# EAGLE design LEDRing (EAGLE 8.0.0)
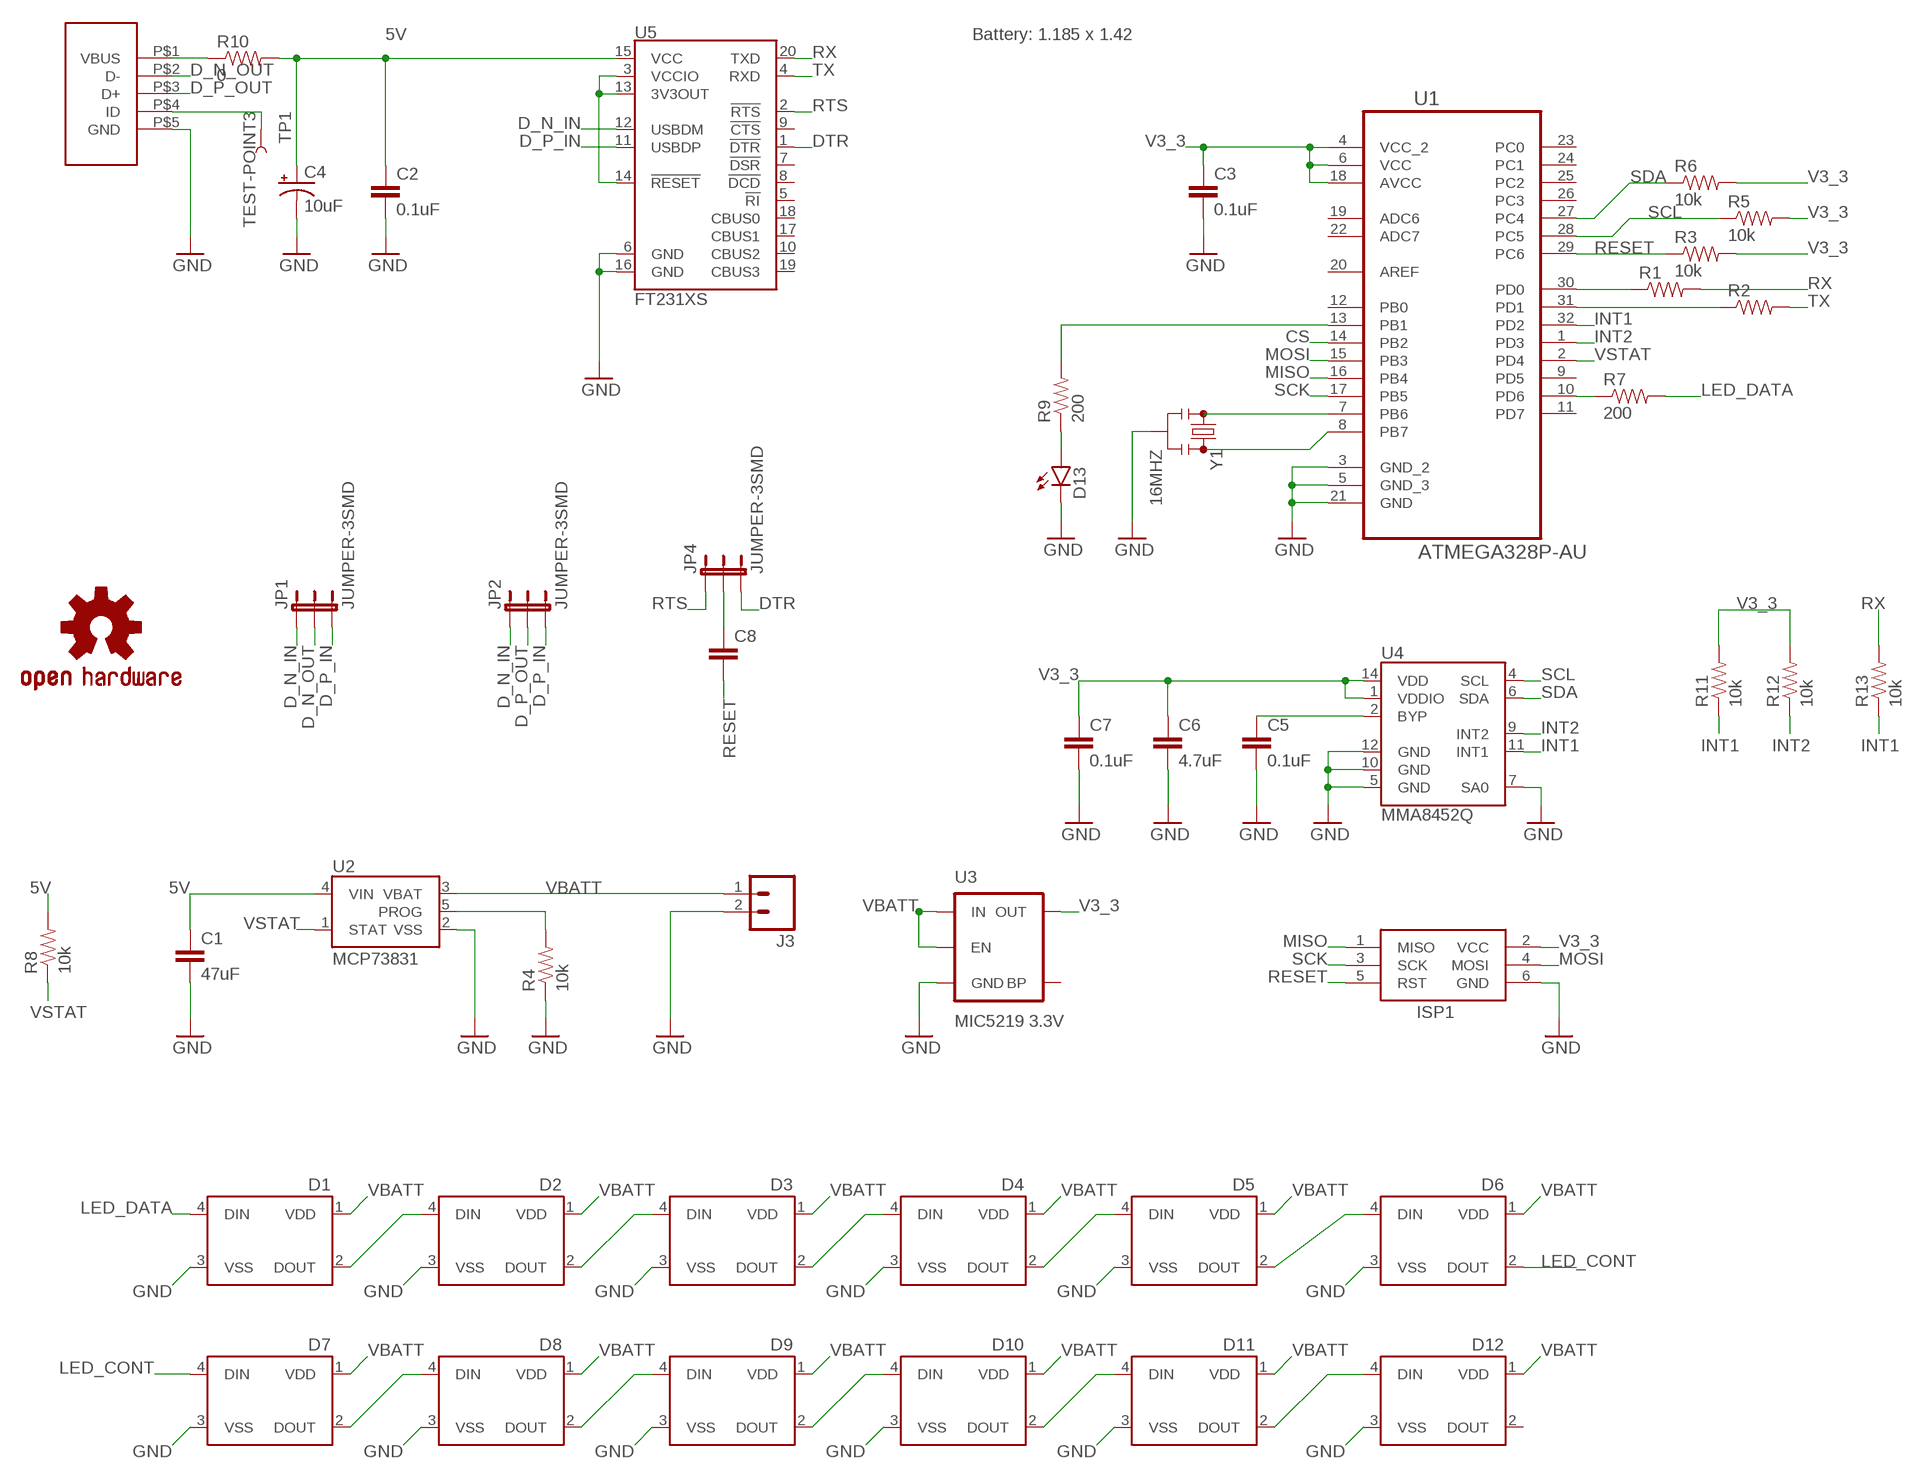
[diagram p0: schematic, sheet 1, part 1 of 2]
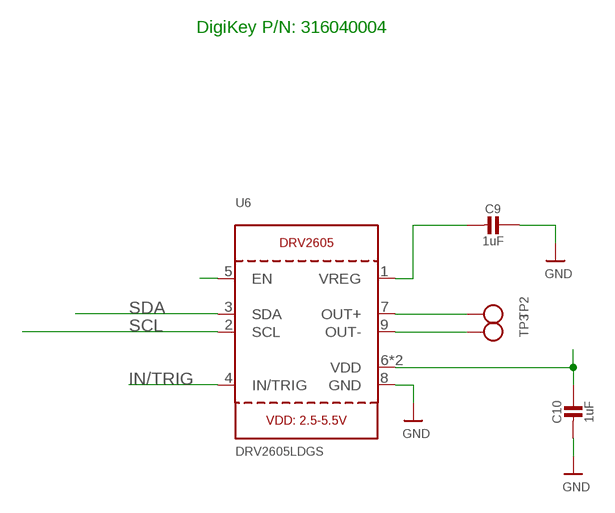
[diagram p1: schematic, sheet 1, part 2 of 2]

## Parts
C1  47uF  CAP0603-CAP  [0603-CAP]
C2  0.1uF  CAP0603-CAP  [0603-CAP]
C3  0.1uF  CAP0603-CAP  [0603-CAP]
C4  10uF  10UF-6.3V-20%(0603)(TANT)"  [0603-POL]
C5  0.1uF  CAP0603-CAP  [0603-CAP]
C6  4.7uF  CAP0603-CAP  [0603-CAP]
C7  0.1uF  CAP0603-CAP  [0603-CAP]
C8  CAP0603-CAP  [0603-CAP]
C9  1uF  CAP_CERAMIC0805-NOOUTLINE  [0805-NO]
C10  1uF  CAP_CERAMIC0805-NOOUTLINE  [0805-NO]
D1  WS2812B  [WS2812B]
D2  WS2812B  [WS2812B]
D3  WS2812B  [WS2812B]
D4  WS2812B  [WS2812B]
D5  WS2812B  [WS2812B]
D6  WS2812B  [WS2812B]
D7  WS2812B  [WS2812B]
D8  WS2812B  [WS2812B]
D9  WS2812B  [WS2812B]
D10  WS2812B  [WS2812B]
D11  WS2812B  [WS2812B]
D12  WS2812B  [WS2812B]
D13  LED0603  [LED-0603]
ISP1  AVRISP-BOX  [AVRISP-BOX]
J3  M02PTH  [1X02]
JP1  JUMPER-3SMD  [SJ_3]
JP2  JUMPER-3SMD  [SJ_3]
JP4  JUMPER-3SMD  [SJ_3]
LOGO1  OSHW-LOGOMINI  [OSHW-LOGO-MINI]
R1  RESISTOR0603-RES  [0603-RES]
R2  RESISTOR0603-RES  [0603-RES]
R3  10k  RESISTOR0603-RES  [0603-RES]
R4  10k  RESISTOR0603-RES  [0603-RES]
R5  10k  RESISTOR0603-RES  [0603-RES]
R6  10k  RESISTOR0603-RES  [0603-RES]
R7  200  RESISTOR0603-RES  [0603-RES]
R8  10k  RESISTOR0603-RES  [0603-RES]
R9  200  RESISTOR0603-RES  [0603-RES]
R10  0  RESISTOR0603-RES  [0603-RES]
R11  10k  RESISTOR0603-RES  [0603-RES]
R12  10k  RESISTOR0603-RES  [0603-RES]
R13  10k  RESISTOR0603-RES  [0603-RES]
TP1  TEST-POINT3  [PAD.03X.03]
TP2  TESTPOINTPAD2MM  [TESTPOINT_PAD_2MM]
TP3  TESTPOINTPAD2MM  [TESTPOINT_PAD_2MM]
U1  ATMEGA328P-AU  [QFP80P900X900X120-32N]
U2  MCP73831  [SOT23-5]
U3  MIC5219 3.3V  V_REG_MIC52193.3V  [SOT23-5]
U4  MMA8452Q  [QFN-16_0.5MM]
U5  FT231XS  [SSOP20_L]
U6  DRV2605LDGS  DRV2605_SOP  [PSOP10]
U$1  TE_USB_A121025CT  [TE_USB_A121025CT]
Y1  16MHZ  RESONATOR16MHZ  [RESONATOR-SMD]

## Nets
5V: C1.1 C2.1 C4.A(+) R8.2 R10.2 U2.4(VIN) U5.15(VCC)
CS: U1.14(PB2)
D_N_IN: JP1.1 JP2.1 U5.12(USBDM)
D_N_OUT: JP1.2 U$1.P$2(D-)
D_P_IN: JP1.3 JP2.3 U5.11(USBDP)
D_P_OUT: JP2.2 U$1.P$3(D+)
DTR: JP4.3 U5.1(!DTR)
GND: C1.2 C2.2 C3.2 C4.K(-) C5.2 C6.2 C7.2 C9.1 C10.2 D1.3(VSS) D2.3(VSS) D3.3(VSS) D4.3(VSS) D5.3(VSS) D6.3(VSS) D7.3(VSS) D8.3(VSS) D9.3(VSS) D10.3(VSS) D11.3(VSS) D12.3(VSS) D13.C ISP1.6(GND) J3.2 R4.1 U1.3(GND_2) U1.5(GND_3) U1.21(GND) U2.2(VSS) U3.2(GND) U4.5(GND) U4.7(SA0) U4.10(GND) U4.12(GND) U5.6(GND) U5.16(GND) U6.8(GND) U$1.P$5(GND) Y1.2
IN/TRIG: U6.4(IN/TRIG)
INT1: R11.1 R13.1 U1.32(PD2) U4.11(INT1)
INT2: R12.1 U1.1(PD3) U4.9(INT2)
LED_CONT: D6.2(DOUT) D7.4(DIN)
LED_DATA: D1.4(DIN) R7.2
MISO: ISP1.1(MISO) U1.16(PB4)
MOSI: ISP1.4(MOSI) U1.15(PB3)
N$1: R1.1 U1.30(PD0)
N$2: R2.1 U1.31(PD1)
N$3: C5.1 U4.2(BYP)
N$4: R10.1 U$1.P$1(VBUS)
N$5: U5.3(VCCIO) U5.13(3V3OUT) U5.14(!RESET)
N$7: U1.8(PB7) Y1.3
N$8: U1.7(PB6) Y1.1
N$9: R4.2 U2.5(PROG)
N$10: R7.1 U1.10(PD6)
N$15: D1.2(DOUT) D2.4(DIN)
N$16: D2.2(DOUT) D3.4(DIN)
N$17: D3.2(DOUT) D4.4(DIN)
N$18: D4.2(DOUT) D5.4(DIN)
N$19: D5.2(DOUT) D6.4(DIN)
N$20: D7.2(DOUT) D8.4(DIN)
N$21: D8.2(DOUT) D9.4(DIN)
N$22: D9.2(DOUT) D10.4(DIN)
N$23: D10.2(DOUT) D11.4(DIN)
N$24: D11.2(DOUT) D12.4(DIN)
N$32: C9.2 U6.1(VREG)
N$33: R9.2 U1.13(PB1)
N$34: D13.A R9.1
N$35: TP1.P$1 U$1.P$4(ID)
N$36: C10.1 U6.6(VDD) U6.10(VDD)
N$37: U6.5(EN)
OUT+: TP2.P$1 U6.7(OUT+)
OUT-: TP3.P$1 U6.9(OUT-)
RESET: C8.2 ISP1.5(RST) R3.1 U1.29(PC6)
RTS: JP4.1 U5.2(!RTS)
RTS_OR_DTR: C8.1 JP4.2
RX: R1.2 R13.2 U5.20(TXD)
SCK: ISP1.3(SCK) U1.17(PB5)
SCL: R5.1 U1.28(PC5) U4.4(SCL) U6.2(SCL)
SDA: R6.1 U1.27(PC4) U4.6(SDA) U6.3(SDA)
TX: R2.2 U5.4(RXD)
V3_3: C3.1 C6.1 C7.1 ISP1.2(VCC) R3.2 R5.2 R6.2 R11.2 R12.2 U1.4(VCC_2) U1.6(VCC) U1.18(AVCC) U3.5(OUT) U4.1(VDDIO) U4.14(VDD)
VBATT: D1.1(VDD) D2.1(VDD) D3.1(VDD) D4.1(VDD) D5.1(VDD) D6.1(VDD) D7.1(VDD) D8.1(VDD) D9.1(VDD) D10.1(VDD) D11.1(VDD) D12.1(VDD) J3.1 U2.3(VBAT) U3.1(IN) U3.3(EN)
VSTAT: R8.1 U1.2(PD4) U2.1(STAT)
Unconnected: D12.2(DOUT) U1.9(PD5) U1.11(PD7) U1.12(PB0) U1.19(ADC6) U1.20(AREF) U1.22(ADC7) U1.23(PC0) U1.24(PC1) U1.25(PC2) U1.26(PC3) U3.4(BP) U5.5(!RI) U5.7(!DSR) U5.8(!DCD) U5.9(!CTS) U5.10(CBUS2) U5.17(CBUS1) U5.18(CBUS0) U5.19(CBUS3)

## Notes on the sheet
- Battery: 1.185 x 1.42
- DigiKey P/N: 316040004

## Library data of the parts
C1-C3 C5-C8 = SparkFun-Capacitors:CAP: Capacitor Standard 0603 ceramic capacitor, and 0.1" leaded capacitor.
C4 = SparkFun-Capacitors:10UF-6.3V-20%(0603)(TANT); PROD_ID: CAP-13210
C9 C10 = microbuilder:CAP_CERAMIC: Ceramic Capacitors For new designs, use the packages preceded by an '_' character since they are more reliable: The following footprints should be used on most boards: _0402 - Standard footprint for regular board layouts _0603 - Standard footprint for regular board layouts _0805 - Standard footprint for regular board layouts _1206 - Standard footprint for regular board layouts For extremely tight-pitch boards where space is at a premium, the following 'micro-pitch' footprints can be used (smaller pads, no silkscreen outline, etc.): _0402MP - Micro-pitch footprint for very dense/compact boards _0603MP - Micro-pitch footprint for very dense/compact boards _0805MP - Micro-pitch footprint for very dense/compact boards _1206MP - Micro-pitch footprint for very dense/compact boards
D1-D12 = SparkFun-LED:WS2812B: WS2812B - Intelligent control LED integrated light source Technical Specifications: Power Supply Voltage (VDD): 3.5 to 5.3 V Input Voltage (VI): -0.5 to VDD+0.5 V Operating Junction Temperature (Topt): -25°C to +80°C Storage Temperature Range (Tstg): -55°C to +150°C; PROD_ID: DIO-12503
D13 = SparkFun-LED:LED: LEDs Standard schematic elements and footprints for 5mm, 3mm, 1206, and 0603 sized LEDs. 5mm - Spark Fun Electronics SKU : COM-00529 (and others)
ISP1 = adafruit:AVRISP: AVR ISP HEADER Standard 6 pin header for AVR programming
J3 = SparkFun-Connectors:M02: Standard 2-pin 0.1" header. Use with - straight break away headers ( PRT-00116) - right angle break away headers (PRT-00553) - swiss pins (PRT-00743) - machine pins (PRT-00117) - female headers (PRT-00115) Molex polarized connector foot print use with: PRT-08233 with associated crimp pins and housings. 2.54_SCREWTERM for use with PRT-10571. 3.5mm Screw Terminal footprints for PRT-08084 5mm Screw Terminal footprints for use with PRT-08432
JP1 JP2 JP4 = SparkFun-Retired:JUMPER-3
LOGO1 = SparkFun-Aesthetics:OSHW-LOGO: Open Source Hardware Logo This logo indicates the piece of hardware it is found on incorporates a OSHW license and/or adheres to the definition of open source hardware found here: http://freedomdefined.org/OSHW
R1-R13 = SparkFun-Passives:RESISTOR: Resistor Basic schematic elements and footprints for 0603, 1206, and PTH resistors.
TP1 = SparkFun-Passives:TEST-POINT: Bare copper test points for troubleshooting or ICT
TP2 TP3 = microbuilder:TESTPOINT: Test Point Various test points for characterisation and PCB testing TESTPOINT_SMT - Compact Surface Mount Test Point [Digikey: 5016KTR-ND]
U1 = Atmel_By_element14_Batch_1-00:ATMEGA328P-AU: 8-bit Microcontroller with In-System Programmable Flash; MPN: ATMEGA328P-AU; OC_FARNELL: 1715486; OC_NEWARK: 14R4631; PACKAGE: TQFP-32; SUPPLIER: Atmel
U2 = SparkFun-PowerIC:MCP73831: Miniature single cell, fully integrated Li-Ion, Li-polymer charge management controller http://ww1.microchip.com/downloads/en/DeviceDoc/20001984g.pdf IC-09995; PROD_ID: IC-09995
U3 = SparkFun-PowerIC:V_REG_MIC5219: V_REG MIC5219 Standard 3.3V and 5V 500mA LDO voltage regulator in SOT-23 layout. Micrel part MIC5219. BP (by-pass) pin is used to lower output noise with 470pF cap, may be left open.; PROD_ID: VREG-09872
U4 = SparkFun-Sensors:MMA8452Q: MMA8452Q 3-Axis, 12/8-bit Digital Accelerometer Supply Voltage: 1.6-3.6V Range: +/- 2g, 4g, 8g Interface: I2C, 12-bit and 8-bit ODR: 1.56 Hz - 800 Hz Package: QFN-16 http://cache.freescale.com/files/sensors/doc/data_sheet/MMA8452Q.pdf; PROD_ID: IC-10769
U5 = SparkFun-DigitalIC:FT231X: FTDI FT231X Full Speed USB to Full-handshake UART This USB2.0 Full Speed IC offers a compact bridge to full handshake UART interfaces. The device is a UART, capable of operating up to 3MBaud, with low power consumption (8mA). The FT231X includes the complete FT-X series feature set and enables USB to be added into a system design quickly and easily over a UART interface.; PROD_ID: IC-11524
U6 = microbuilder:DRV2605: DRV2605 - Haptic Driver for ERM/LRA Motors
U$1 = LEDRingLib:TE_USB_A121025CT: TE USB Micro USB IP68 Digikey <http://www.digikey.com/en/ptm/t/te-connectivity/te-connectivity-amp/ip68-micro-usb?pn_sku=A121025CT-ND&part_id=5215144&video_source=Part_Detail>
Y1 = SparkFun-FreqCtrl:RESONATOR: Resonator Small SMD resonator. Used, eg, on the Arduino Pro/ Pro Mini boards. 8MHz- XTAL-08895 16MHz- XTAL-08900; PROD_ID: XTAL-08900

## Board
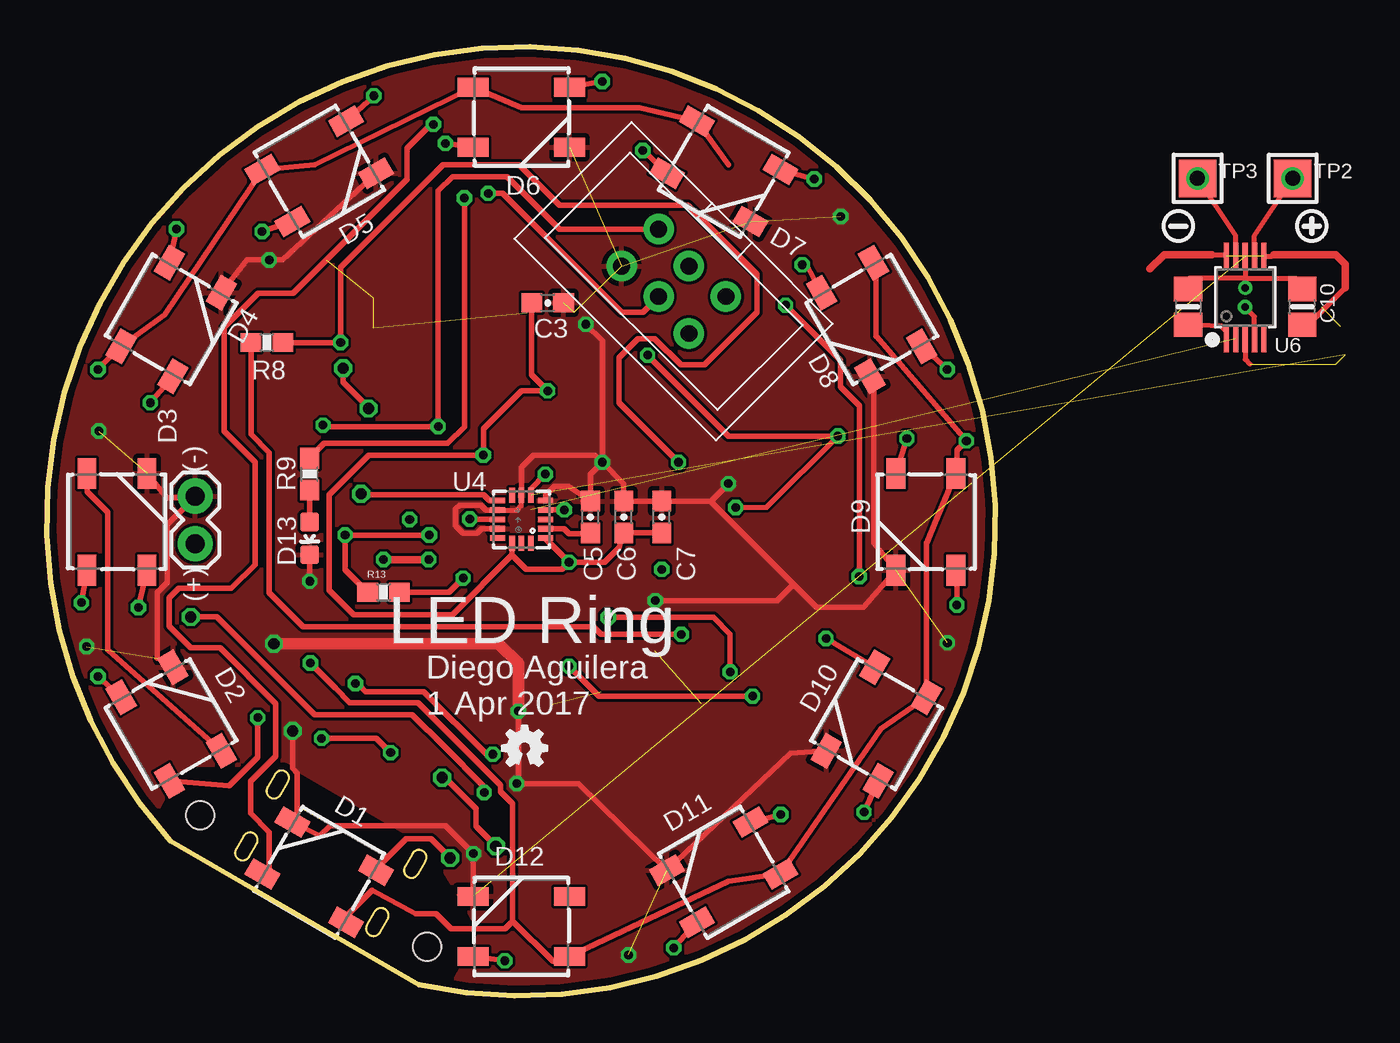
[diagram p2: board, top side]
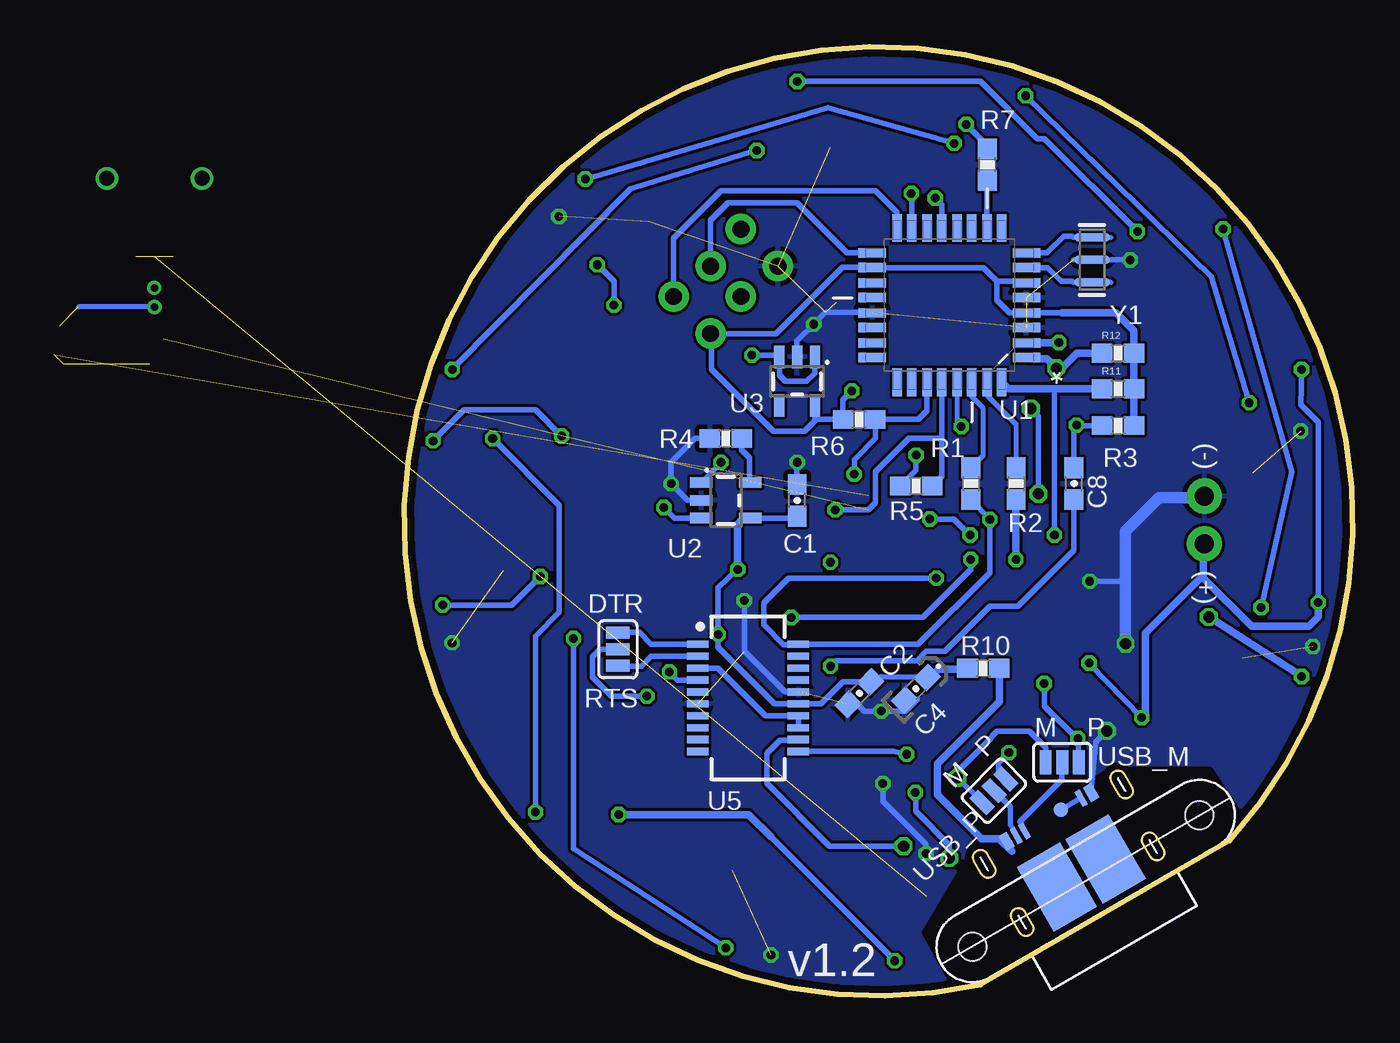
[diagram p3: board, bottom side, seen from below]

Size 50.62 x 50.64 mm. Coordinates in mm from the lower left corner, seen from the top.
Outline: 6.57,8.29 19.87,0.59 arc325 6.57,8.29
Copper layers (1*16): Top 0.0356mm / dielectric 1.5011mm / Bottom 0.0356mm
Design rules "oshpark-2layer": minimum track width 6mil, minimum drill 13mil, track to track 6mil, track to pad 6mil, pad to pad 6mil, via to via 6mil, smd to smd 6mil, copper to edge 15mil, drill to drill 6mil, minimum pad ring 7mil, minimum via ring 7mil, stop-mask expansion 2.5mil, vias tented up to drill 0mil, thermal gap 10mil

### Footprints (pad centres in the part's own frame; a part is rotated, then mirrored left to right if it is on the bottom)
0603-CAP = smd 1.1 x 1: 1 -0.85,0; 2 0.85,0
0603-POL = smd 1.1 x 1: A 0.85,0; K -0.85,0
0805-NO = smd 1.3 x 1.5: 1 -0.95,0; 2 0.95,0
WS2812B = smd 1.651 x 1: 1 -2.577,1.6; 2 -2.577,-1.6; 3 2.577,-1.6; 4 2.577,1.6
LED-0603 = smd 1 x 1: A 0,-0.877; C 0,0.877
AVRISP-BOX = drill 0.9 pad 1.626: 1 -1.397,2.54; 2 1.397,2.54; 3 -1.143,0; 4 1.143,0; 5 -1.397,-2.54; 6 1.397,-2.54
1X02 = drill 1.016 pad 1.88: 1 0,0; 2 2.54,0
SJ_3 = smd 0.635 x 1.27: 1 -0.889,0; 2 0,0; 3 0.889,0
0603-RES = smd 1.1 x 1: 1 -0.85,0; 2 0.85,0
PAD.03X.03 = smd 0.762 x 0.762: P$1 0,0
TESTPOINT_PAD_2MM = smd 2 x 2: P$1 0,0
QFP80P900X900X120-32N = smd 1.473 x 0.508: 1 -4.115,2.794; 2 -4.115,2.007; 3 -4.115,1.194; 4 -4.115,0.406; 5 -4.115,-0.406; 6 -4.115,-1.194; 7 -4.115,-2.007; 8 -4.115,-2.794; 17 4.115,-2.794; 18 4.115,-2.007; 19 4.115,-1.194; 20 4.115,-0.406; 21 4.115,0.406; 22 4.115,1.194; 23 4.115,2.007; 24 4.115,2.794 | smd 0.508 x 1.473: 9 -2.794,-4.115; 10 -2.007,-4.115; 11 -1.194,-4.115; 12 -0.406,-4.115; 13 0.406,-4.115; 14 1.194,-4.115; 15 2.007,-4.115; 16 2.794,-4.115; 25 2.794,4.115; 26 2.007,4.115; 27 1.194,4.115; 28 0.406,4.115; 29 -0.406,4.115; 30 -1.194,4.115; 31 -2.007,4.115; 32 -2.794,4.115
SOT23-5 = smd 0.55 x 1.2: 1 -0.95,-1.3; 2 0,-1.3; 3 0.95,-1.3; 4 0.95,1.3; 5 -0.95,1.3
QFN-16_0.5MM = smd 0.8 x 0.3: 1 -1.275,1; 2 -1.275,0.5; 3 -1.275,0; 4 -1.275,-0.5; 5 -1.275,-1; 9 1.275,-1; 10 1.275,-0.5; 11 1.275,0; 12 1.275,0.5; 13 1.275,1 | smd 0.3 x 0.8: 6 -0.5,-1.275; 7 0,-1.275; 8 0.5,-1.275; 14 0.5,1.275; 15 0,1.275; 16 -0.5,1.275
SSOP20_L = smd 0.381 x 1.143: 1 -2.857,-2.68; 2 -2.223,-2.68; 3 -1.587,-2.68; 4 -0.953,-2.68; 5 -0.318,-2.68; 6 0.318,-2.68; 7 0.953,-2.68; 8 1.587,-2.68; 9 2.223,-2.68; 10 2.857,-2.68; 11 2.857,2.68; 12 2.223,2.68; 13 1.587,2.68; 14 0.953,2.68; 15 0.318,2.68; 16 -0.318,2.68; 17 -0.953,2.68; 18 -1.587,2.68; 19 -2.223,2.68; 20 -2.857,2.68
PSOP10 = smd 0.28 x 1.45: 1 -1,-2.2; 2 -0.5,-2.2; 3 0,-2.2; 4 0.5,-2.2; 5 1,-2.2; 6 1,2.2; 7 0.5,2.2; 8 0,2.2; 9 -0.5,2.2; 10 -1,2.2
TE_USB_A121025CT = smd 0.5 x 0.9: P$1 2.6,-5.75; P$5 -2.6,-5.75 | smd 0.3 x 0.9: P$2 2,-5.75; P$3 1.5,-5.75; P$4 -2,-5.75 | smd 2.65 x 3.98: P$6 -1.5,-2.29; P$7 1.5,-2.29 | hole 1.5: -7,-1.8; 7,-1.8
RESONATOR-SMD = smd 0.45 x 1.905: 1 -1.2,0; 2 0,0; 3 1.2,0

### Placement (x,y rotation side)
C1  29.65,26.44 90 bottom
C2  26.33,16.15 225 bottom
C3  26.73,36.98 0 top
C4  23.32,16.39 45 bottom
C5  29.02,25.55 90 top
C6  30.8,25.55 90 top
C7  32.83,25.55 90 top
C8  14.88,27.33 90 bottom
C9  60.91,36.76 270 top  (outside the outline)
C10  67.01,36.76 90 top  (outside the outline)
D1  14.54,6.6 150 top
D2  6.64,14.5 120 top
D3  3.74,25.3 90 top
D4  6.64,36.09 60 top
D5  14.54,43.99 30 top
D6  25.33,46.89 0 top
D7  36.13,43.99 330 top
D8  44.03,36.09 300 top
D9  46.92,25.3 270 top
D10  44.28,14.5 240 top
D11  36.13,6.6 210 top
D12  25.33,3.71 180 top
D13  14.03,24.41 180 top
ISP1  33.46,38.12 225 top
J3  7.92,24.13 90 top
JP1  19.14,10.95 45 bottom
JP2  15.5,12.47 0 bottom
JP4  39.22,18.49 90 bottom
LOGO1  25.5,13.23 0 top
R1  20.38,27.33 270 bottom
R2  17.97,27.33 270 bottom
R3  12.52,30.43 0 bottom
R4  33.46,29.74 0 bottom
R5  23.3,27.2 180 bottom
R6  26.35,30.76 180 bottom
R7  19.49,44.35 90 bottom
R8  11.75,34.86 180 top
R9  14.03,27.84 90 top
R10  19.72,17.47 180 bottom
R11  12.52,32.39 0 bottom
R12  12.52,34.29 0 bottom
R13  17.97,21.54 0 top
TP1  15.57,9.94 0 bottom
TP2  66.5,43.62 0 top  (outside the outline)
TP3  61.42,43.62 0 top  (outside the outline)
U1  21.52,36.85 180 bottom
U2  33.46,26.44 270 bottom
U3  29.65,32.79 180 bottom
U4  25.33,25.42 180 top
U5  32.27,15.9 270 bottom
U6  63.96,37.27 0 top  (outside the outline)
U$1  13.35,4.57 210 bottom
U$5  [SYMBOL_PLUS]  67.52,41.08 90 top  (outside the outline)
U$13  [SYMBOL_MINUS]  60.41,41.08 0 top  (outside the outline)
Y1  13.9,39.27 90 bottom

### Tracks (layer width: path | path; a pad name or v marks a point on that pad's centre or on a via)
5V  (via drill 0.46, 0.46 pad 0.25)
  Top 0.305: R8.2 10.9,29.96 11.87,28.98 11.87,22.63 11.87,21.5 13.14,20.23 13.67,19.7 13.67,19.69 29.17,19.69 29.57,19.29 v33.87,19.29
  Bottom 0.305: U2.4 29.75,25.49 C1.1 | C4.A 25.19,17.04 C2.1 27.21,16.75 28.37,15.59 U5.15 30.27,15.58 30.27,15.59 30.87,15.59 33.87,18.59 v33.87,19.29 33.87,21.79 v32.83,22.76
  Bottom 0.406: U2.4 32.51,25.49 32.83,25.17 v32.83,22.76 | R10.2 20.6,17.44 22.12,17.44 22.57,16.99 C4.A
D_N_IN  (via drill 0.6 pad 0.25)
  Top 0.305: v21.1,11.65 21.26,11.65 22.92,9.99 22.92,9.04 v23.97,7.99
  Bottom 0.305: JP1.1 v21.1,11.65 21.1,11.96 19.32,13.74 19.24,13.87 18.98,14.12 17.25,14.12 16.37,13.24 16.37,12.49 JP2.1 | v23.97,7.99 27.92,7.99 31.27,11.34 31.27,12.94 30.57,13.64 29.63,13.64 U5.12
D_N_OUT
  Bottom 0.305: JP1.2 18.27,10.09 18.27,9.14 U$1.P$2
D_P_IN  (via drill 0.46)
  Top 0.305: v18.35,12.98 17.59,13.74 v14.67,13.74 | v23.81,12.89 23.81,12.85 23.77,12.89 23.47,12.89 20.12,16.24 17.02,16.24 16.59,16.67 v16.47,16.67
  Bottom 0.305: 18.37,12.95 v18.35,12.98 18.38,12.98 18.92,12.44 18.92,11.99 JP1.3 | 14.6,13.68 v14.67,13.74 | U5.11 24.51,13.04 v23.81,12.89 | v14.67,13.74 14.73,13.74 16.42,15.44 16.47,15.48 v16.47,16.67 | JP2.3 v14.67,13.74
D_P_OUT
  Bottom 0.305: JP2.2 15.52,12.45 15.52,11.54 17.77,9.29 U$1.P$3
DTR
  Bottom 0.305: U5.1 37.44,18.76 38.07,19.39 JP4.3
GND  (via drill 0.39, 0.46, 0.46 pad 0.25, 0.6, 0.6 pad 0.25)  (15 unrouted)
  Top 0.254: U4.7 25.32,26.69 25.32,26.14 25.11,25.92 U4.10 | U6.8 v63.96,37.77 63.96,38.28 | 63.96,38.28 60.98,38.28 C9.1 | 63.96,38.28 66.69,38.28 C10.2
  Top 0.305: 28.61,26.42 C5.2 | U4.5 26.61,26.7 27.11,27.2 27.84,27.2 C5.2 | C5.2 29.02,27.84 v29.65,28.47 | v29.65,28.47 30.8,27.33 C6.2 C7.2 35.46,26.4 35.49,26.44 | v29.65,28.47 29.65,34.95 v28.76,35.84 | U4.7 25.33,28.22 25.97,28.85 29.27,28.85 v29.65,28.47 | D2.3 5.9,18.01 5.9,21.52 6.42,22.04 6.42,25.14 7.92,26.64 J3.2 7.81,26.57 6.4,26.57 D3.3 | D10.3 39.7,12.94 D11.3 28.37,11.33 v25.08,11.33 25.17,11.42 v25.17,15.19 | D8.3 43.92,33.09 44.16,32.85 44.16,24.14 D9.3 43.58,20.72 41.08,20.72 39.85,21.96 | v36.38,27.33 35.49,26.44 | 35.49,26.44 35.49,26.31 39.85,21.96 | D4.3 10.7,39.27 v11.87,39.27 12.59,39.27 D5.3 | D13.C v14.03,22.12 | D12.3 22.76,7.57 v22.77,7.59 21.27,9.09 15.12,9.09 14.57,8.54 D1.3 13.37,9.54 13.37,11.89 13.12,12.14 v13.12,14.14 | v32.47,21.09 38.97,21.09 39.85,21.96 | U4.10 23.44,25.92 23.17,26.19 22.02,26.19 21.82,25.99 21.82,25.09 22.22,24.69 22.97,24.69 23.21,24.92 U4.12
  Top 0.61: v12.12,18.79 24.12,18.79 25.17,17.74 v25.17,15.19
  Bottom 0.305: R4.1 35.11,29.74 36.38,28.47 v36.38,27.33 35.49,26.44 U2.2 | U3.2 29.65,34.95 v28.76,35.84 28.13,36.47 25.66,36.47 U1.21 | C1.2 v29.65,28.47 | v11.87,39.27 12.89,39.27 | v14.03,22.12 12.25,22.12 12.13,22.25 | C4.K 23.22,15.84 23.87,15.19 v25.17,15.19 26.07,15.19 26.44,15.55 C2.2 | v25.08,11.33 v25.07,11.32 25.07,10.39 22.77,8.09 v22.77,7.59 | U5.16 30.3,16.22 32.47,18.39 v32.47,21.09 | U$1.P$5 13.7,13.57 v13.12,14.14
  Bottom 0.61: v12.12,18.79 12.13,20.13 12.13,22.25 12.13,24.79 10.35,26.57 8.02,26.57 J3.2
  other vias: 31.05,2.18 48.07,18.84 2.77,30.14 42.37,41.59 2.12,18.64
  pour Bottom: -0.7,-0.48 52.26,-0.48 52.26,52.47 -0.7,52.47
  pour Top: -0.7,-0.48 52.89,-0.48 52.89,53.62 -0.7,53.62
IN/TRIG  (via drill 0.4)  (1 unrouted)
  Top 0.254: U6.4 64.46,36.26 v63.96,36.76
  Bottom 0.254: v63.96,36.76 68.03,36.76
INT1  (via drill 0.46 pad 0.25)
  Top 0.305: U4.11 23.09,25.42 v22.57,25.44 | v20.42,24.59 v15.92,24.59 15.92,22.74 R13.1
  Bottom 0.305: v22.57,25.44 21.27,25.44 v20.42,24.59 | v15.92,24.59 15.92,32.34 15.97,32.39
  Bottom 0.406: R11.1 15.97,32.39 18.38,32.39 U1.32
INT2  (via drill 0.6 pad 0.25)
  Top 0.305: U4.9 23.64,26.42 23.32,26.74 16.82,26.74 v16.77,26.79 | v17.17,31.34 17.17,31.39 15.82,32.74 v15.82,33.49
  Bottom 0.305: v16.77,26.79 16.77,30.94 v17.17,31.34
  Bottom 0.406: R12.1 14.72,34.29 15.52,33.49 v15.82,33.49 16.32,33.99 17.34,33.99 U1.1
LED_CONT  (via drill 0.46 pad 0.25)
  Top 0.305: D7.4 v40.96,43.58 | D6.2 v21.27,45.49
  Bottom 0.305: v40.96,43.58 28,47.39 v21.27,45.49
LED_DATA  (via drill 0.46 pad 0.25)
  Top 0.305: v20.64,46.51 20.51,46.51 19.24,45.24 19.24,43.58 13.14,37.49 11.27,37.49 9.46,35.68 9.46,30.12 11.11,28.47 11.11,23.01 9.84,21.74 7.05,21.74 6.54,21.23 6.54,19.71 7.68,18.57 9.25,18.57 12.22,15.59 12.22,12.79 10.87,11.44 10.87,9.74 11.87,8.74 11.87,6.87 D1.4
  Bottom 0.305: R7.2 19.49,45.36 v20.64,46.51
MISO
  Bottom 0.305: ISP1.1 36.25,40.42 33.72,42.95 25.46,42.95 24.32,41.81 U1.16
MOSI  (via drill 0.46 pad 0.25)
  Top 0.305: ISP1.4 31.81,36.47 30.67,36.47 24.32,42.82 v23.56,42.82
  Bottom 0.305: U1.15 23.53,42.8 v23.56,42.82
N$1
  Bottom 0.254: U1.30 20.33,31.98 19.75,31.39 19.75,28.81 R1.1
  Bottom 0.305: R1.1 20.33,28.18
N$2
  Bottom 0.254: U1.31 19.52,32.05 17.97,30.5 R2.1
N$3
  Top 0.305: U4.2 27.61,24.92 27.87,24.66 28.6,24.66 C5.1
N$4
  Bottom 0.406: U$1.P$1 18.2,7.72 18.87,8.39 19.82,8.39 22.17,10.74 22.17,12.39 18.87,15.69 R10.1
N$5
  Bottom 0.305: U5.13 U5.14 31.33,14.95 33.87,17.49 U5.3
N$7
  Bottom 0.305: U1.8 16.32,39.65 15.43,40.54 14.99,40.54 14.92,40.47
N$8
  Bottom 0.305: U1.7 16.29,38.86 15.56,38.12 14.98,38.12 14.92,38.07
N$9
  Bottom 0.305: R4.2 32.61,29.15 32.19,28.73 32.19,27.42 U2.5
N$10
  Bottom 0.305: R7.1 19.52,43.47 U1.10
N$15  (via drill 0.46 pad 0.25, 0.6)
  Top 0.305: D2.4 v2.73,17.04 | v7.68,20.22 9.08,20.22 14.29,15.01 19.49,15.01 21.19,13.31 23.32,11.19 23.32,10.87 v23.34,10.85 | D1.2 17.57,6.79 19.17,8.39 20.5,8.39 v21.53,7.36
  Bottom 0.305: v21.53,7.36 v21.52,7.37 21.52,8.04 23.32,9.84 23.32,10.83 v23.34,10.85
  Bottom 0.406: v7.68,20.22 v2.73,17.04 2.86,17.04
N$16
  Top 0.305: D2.2 3.24,18.46 3.24,25.8 2.14,26.9 D3.4
N$17  (via drill 0.46 pad 0.25)
  Top 0.305: D4.4 v6.92,40.92 | D3.2 v4.89,20.72
  Bottom 0.305: v6.92,40.92 3.24,27.96 v4.89,20.72
N$18  (via drill 0.46 pad 0.25)
  Top 0.305: D5.4 v17.46,48.03 | D4.2 v5.52,31.65
  Bottom 0.305: v17.46,48.03 7.55,38.38 v5.52,31.65
N$19  (via drill 0.46 pad 0.25)
  Top 0.305: D6.4 v29.65,48.79 | D5.2 v11.49,40.79
  Bottom 0.305: v11.49,40.79 16.44,45.74 16.83,45.74 19.87,48.79 v29.65,48.79
N$20  (via drill 0.46 pad 0.25)
  Top 0.305: D8.4 v48.07,33.42 | D7.2 v31.81,45.11
  Bottom 0.305: v48.07,33.42 38.54,43.08 v31.81,45.11
N$21  (via drill 0.46 pad 0.25)
  Top 0.305: D9.4 48.58,22.61 v48.58,20.85 | D8.2 40.55,39.01 v40.32,39.01 | v39.43,36.85 42.37,33.91 42.37,32.49 43.37,31.49 v43.37,22.38
  Bottom 0.305: v48.58,20.85 44.89,20.85 v43.37,22.38 | v39.43,36.85 39.43,38.12 v40.32,39.01
N$22  (via drill 0.46 pad 0.25)
  Top 0.305: D9.2 v45.91,29.74 | D10.4 v43.62,9.8
  Bottom 0.305: v43.62,9.8 43.62,19.2 42.35,20.47 42.35,26.19 v45.91,29.74
N$23  (via drill 0.46 pad 0.25)
  Top 0.305: D11.4 v33.46,2.56 | D10.2 v41.59,19.07
  Bottom 0.305: v33.46,2.56 41.46,7.77 41.57,7.84 41.59,7.86 v41.59,19.07
N$24  (via drill 0.46 pad 0.25)
  Top 0.305: D11.2 v39.18,9.68 | D12.4 v24.45,1.87
  Bottom 0.305: 31.05,8.48 v24.45,1.87
  Bottom 0.406: 31.05,8.48 32.25,9.68 v39.18,9.68
N$31
  cutout Bottom (no thermals): 6.57,10.59 7.57,12.09 12.87,12.09 20.27,7.79 22.87,3.39 21.97,1.69 20.17,-1.51 4.97,7.29 4.77,7.39 6.47,10.49
  cutout Top (no thermals): 6.57,10.59 7.57,12.09 12.87,12.09 20.27,7.79 22.87,3.39 21.97,1.69 20.17,-1.51 4.97,7.29 4.77,7.39 6.47,10.49
N$32
  Top 0.254: U6.1 62.96,35.47 62.69,35.74 C9.2
N$33  (via drill 0.46 pad 0.25)
  Top 0.305: v22.29,42.57 22.29,30.38 21.4,29.49 14.79,29.49 14.03,28.73 R9.2
  Bottom 0.305: U1.13 21.93,42.21 v22.29,42.57
N$34
  Top 0.305: R9.1 D13.A
N$35
  Bottom 0.305: TP1.P$1 14.52,10.54 U$1.P$4
N$36  (1 unrouted)
  Top 0.254: 62.18,39.55 62.88,39.55 U6.10 | U6.6 65.4,39.47 65.49,39.55 | 69.36,37.77 69.3,37.77 67.33,35.81 C10.1
  Top 0.406: 58.88,38.79 59.64,39.55 62.18,39.55 | 65.49,39.55 68.79,39.55 69.3,39.04 69.3,37.77
OUT+  (via drill 0.8)
  Top 0.254: 64.46,39.27 U6.7 64.46,40.56 TP2.P$1
  other vias: 66.5,43.62
OUT-  (via drill 0.8)
  Top 0.254: 63.46,39.37 U6.9 63.46,40.56 TP3.P$1
  other vias: 61.42,43.62
RESET  (via drill 0.46 pad 0.25)
  Top 0.305: ISP1.5 27.5,40.91 27.38,40.91 24.57,43.71 21.65,43.71 20.89,42.95 v20.89,30.38 14.82,30.38 v14.74,30.45
  Bottom 0.254: U1.29 21.12,30.61 v20.89,30.38
  Bottom 0.305: R3.1 14.72,30.43 v14.74,30.45 14.88,30.27 C8.2
RTS
  Bottom 0.305: U5.2 37.44,18.12 37.97,17.59 39.21,17.59 JP4.1
RTS_OR_DTR  (via drill 0.46)
  Top 0.305: v37.67,15.99 29.47,15.99 v27.87,17.59
  Bottom 0.305: C8.1 14.87,26.54 14.87,23.79 17.87,20.79 19.37,20.79 21.77,18.39 22.77,18.39 23.27,17.89 27.57,17.89 v27.87,17.59 | JP4.2 40.17,18.49 40.57,18.09 40.57,16.99 39.57,15.99 v37.67,15.99
RX  (via drill 0.46, 0.46 pad 0.25)
  Top 0.305: R13.2 21.47,21.54 v22.22,22.29
  Bottom 0.305: 20.38,26.44 R1.2 v19.37,25.42 19.37,25.42 19.37,22.59 23.2,18.76 U5.20 29.61,18.74 30.37,18.74 31.42,19.79 31.42,20.99 30.12,22.29 v22.22,22.29
SCK
  Bottom 0.305: ISP1.3 34.27,41.38 33.34,42.31 29.65,42.31 26.99,39.65 U1.17
SCL  (via drill 0.46 pad 0.25)  (1 unrouted)
  Top 0.305: v27.62,25.93 U4.4
  Bottom 0.305: U1.28 21.93,29.61 | 21.93,29.61 21.93,27.72 R5.1 | 21.93,29.61 22.06,29.74 23.68,29.74 25.46,27.96 25.46,26.31 25.84,25.93 27.23,25.93 | 27.23,25.93 27.24,25.92 | 27.23,25.93 v27.62,25.93
SDA  (via drill 0.46 pad 0.25)  (4 unrouted)
  Top 0.254: U6.3 63.96,33.96 64.22,33.71
  Top 0.305: U4.6 25.83,27.07 v26.6,27.84
  Bottom 0.305: U1.27 22.72,31.21 23.18,30.76 R6.1 25.46,30.72 25.46,29.74 26.6,28.6 v26.6,27.84
TX  (via drill 0.46, 0.46 pad 0.25)
  Top 0.305: v36.47,17.29 36.47,19.29 35.57,20.19 v29.97,20.19
  Top 0.406: v20.38,23.28 v17.98,23.28 v17.97,23.29
  Bottom 0.305: v20.38,23.28 20.38,22.76 22.95,20.19 v29.97,20.19 | U5.4 36.03,16.85 v36.47,17.29
  Bottom 0.406: R2.2 17.97,23.39 v17.97,23.29
V3_3  (via drill 0.46 pad 0.25)
  Top 0.305: C7.1 C6.1 30.54,23.9 29.78,23.14 v27.87,23.14 | U4.1 26.61,24.4 v27.87,23.14 | v27.87,23.14 27.49,22.76 25.59,22.76 24.83,23.51 U4.14 24.83,23.53 21.65,20.34 16.37,20.34 15.07,21.64 15.07,26.74 17.19,28.85 v23.3,28.85 23.3,30.25 25.33,32.28 v26.73,32.28 | 26.64,32.37 v26.73,32.28 | C3.1 25.88,33.13 v26.73,32.28
  Bottom 0.305: 15.53,36.45 U1.4 18.32,36.45 18.98,37.11 18.98,38.12 | 33.59,35.34 ISP1.2 34.22,35.29 34.22,33.42 30.92,30.12 29.27,30.12 28.7,30.69 | 33.59,35.34 30.79,35.34 27.24,38.89 25.66,38.89 U1.18 19.72,38.86 18.98,38.12 | 18.98,38.12 17.49,38.12 U1.6 | U3.5 28.7,30.69 | 33.59,35.34 33.59,35.2 | 28.7,30.69 28.64,30.76 R6.2 27.2,31.81 v26.73,32.28 | v23.3,28.85 23.3,28.05 R5.2
  Bottom 0.406: 15.53,36.45 12.63,36.45 11.67,35.49 R12.2 R11.2 R3.2
VBATT  (via drill 0.46 pad 0.25)
  Top 0.254: v36.76,26.06 38.42,26.06 v42.23,29.87
  Top 0.305: 36.38,44.35 D7.1 31.65,47.39 25.33,47.39 D6.1 14.29,44.35 D5.1 6.28,36.35 D4.1 v2.73,33.42 | D3.1 v1.84,20.98 | D2.1 9.73,11.22 9.77,11.24 11.26,12.72 v11.26,14.84 | 24.87,3.99 24.47,3.59 21.57,3.59 20.77,4.39 19.67,4.39 17.37,5.64 15.97,4.24 D1.1 | v32.07,34.19 36.38,29.87 v42.23,29.87 | D8.1 44.26,39.15 44.26,35.2 44.27,35.19 v49.08,29.61 48.57,29.1 48.57,28.44 D9.1 47.43,25.3 46.97,24.19 46.96,24.17 D10.1 44.51,14.25 D11.1 36.38,6.12 D12.1 27.01,1.85 24.87,3.99 | 24.87,3.99 24.87,10.24 24.22,10.89 24.22,11.24 19.82,15.64 16.17,15.64 15.4,16.41 v14.07,17.76
  Bottom 0.305: U3.1 28.7,33.23 29.14,32.79 30.29,32.79 30.6,33.1 U3.3 30.7,34.19 v32.07,34.19 | U2.3 36.2,25.49 v36.76,26.06 | v1.84,20.98 1.84,30.61 2.77,31.54 v2.73,33.42 | v42.23,29.87 43.62,31.27 47.43,31.27 v49.08,29.61 | v11.26,14.84 v14.07,17.76
  Bottom 0.406: v1.84,20.98 1.84,20.22 2.35,19.71 5.4,19.71 7.97,22.29 | 7.97,22.29 7.97,24.08 J3.1 | 7.97,22.29 8.12,22.29 11.07,19.34 11.07,15.03 v11.26,14.84
VSTAT  (via drill 0.46 pad 0.25)
  Top 0.305: R8.1 v15.68,34.86 15.68,38.89 21.14,44.35 25.21,44.35 27.37,42.19 34.22,42.19 37.91,38.5 37.91,36.47 35.11,33.68 33.84,33.68 32.45,35.08 31.56,35.08 30.54,34.06 30.54,31.65 v33.72,28.47
  Bottom 0.305: U2.1 33.72,28.44 v33.72,28.47
  Bottom 0.406: U1.2 15.7,34.85 v15.68,34.86

### Text on the board
tPlace: LED Ring | Diego Aguilera / 1 Apr 2017
tNames: (-) | (+)
bNames: (-) | (+) | DTR | RTS | P | M | USB_M | P | M | USB_P | v1.2